# Altium schematic sheet LED Strip.SchDoc
size A
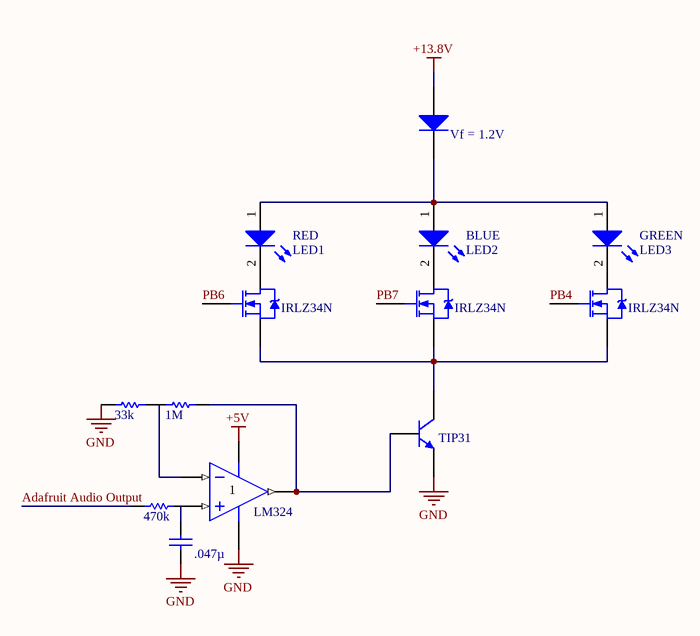
[diagram p0: LED Strip.SchDoc]

## Parts
(Parts that share a designator on the sheet are numbered #1, #2 ... from top to bottom, then left to right.)
BLUE  LED2  [DSO-F2/D6.1]
C?  .047µ  [RAD-0.3]
D?  Vf = 1.2V  [DSO-C2/X3.3]
GREEN  LED3  [DSO-F2/D6.1]
Q?#1  IRLZ34N  [SFM-T3/A4.7V]
Q?#2  IRLZ34N  [SFM-T3/A4.7V]
Q?#3  IRLZ34N  [SFM-T3/A4.7V]
Q?#4  TIP31  [BCY-W3]
R?#1  33k  [AXIAL-0.3]
R?#2  1M  [AXIAL-0.3]
R?#3  470k  [AXIAL-0.3]
RED  LED1  [DSO-F2/D6.1]
U?  LM324  [DIP-14]  (part A of 4)

## Nets
+13.8V: D?.1(A)
GND: C?.1 Q?#4.3(E) R?#1.1 U?.11(GND)
Adafruit Audio Output: R?#3.1
PB4: Q?#3.1(G)
PB6: Q?#1.1(G)
PB7: Q?#2.1(G)
NetBLUE_1: BLUE.1(A) D?.2(K) GREEN.1(A) RED.1(A)
NetC?_2: C?.2 U?.3(IN+)
NetQ?#1_3: Q?#1.3(S) Q?#2.3(S) Q?#3.3(S) Q?#4.1(C)
NetQ?#4_2: Q?#4.2(B) R?#2.2 U?.1(OUT)
NetR?#1_2: R?#1.2 U?.2(IN-)

Not connected (* = marked no-connect by the designer): BLUE 2(K); GREEN 2(K); Q?#1 2(D); Q?#2 2(D); Q?#3 2(D); R?#2 1; R?#3 2; RED 2(K); U? 4(V+)

## Notes on the sheet
- Labels drawn without touching a wire or pin: +5V

## Library data of the parts
BLUE GREEN RED = LED2: Typical RED, GREEN, YELLOW, AMBER GaAs LED; Manufacturer: Generic Components; Class: Optoelectronic; Published: 08/06/2000; Publisher: Altium Hobart Technology Centre; SubClass: LED
C? = Cap: Capacitor; Manufacturer: Generic Components; Class: Passive; Published: 08/06/2000; Publisher: Altium Hobart Technology Centre; SubClass: Capacitor
D? = Diode: Default Diode; Manufacturer: Generic Components; Class: Discrete; SubClass: Diode - Switching; Published: 08/06/2000; Publisher: Altium Hobart Technology Centre
Q?#1-Q?#3 = IRLZ34N: HEXFET Power MOSFET; Manufacturer: International Rectifier; Class: Discrete; SubClass: MOSFET - Power; Note: Pin 2 is electrically connected to pin 4.; Published: 8/06/2000; Publisher: Altium Hobart Technology Centre
Q?#4 = NPN: NPN Bipolar Transistor; Manufacturer: Generic Components; Class: Discrete; SubClass: BJT - Low Power; Published: 08/06/2000; Publisher: Altium Hobart Technology Centre
R?#1-R?#3 = Res1: Resistor; Manufacturer: Generic Components; Class: Passive; Value: 1K; Published: 08/06/2000; Publisher: Altium Hobart Technology Centre; SubClass: Resistor
U? = LM324AJ: Low-Power Quad Operational Amplifier; Manufacturer: National Semiconductor; Published: 15/04/2002; Publisher: Altium Hobart Technology Centre; Class: Amplifier; SubClass: Operational Amplifier